# EAGLE design CHIP SmartPhone Core Rev 0.2 (EAGLE 8.1.1)
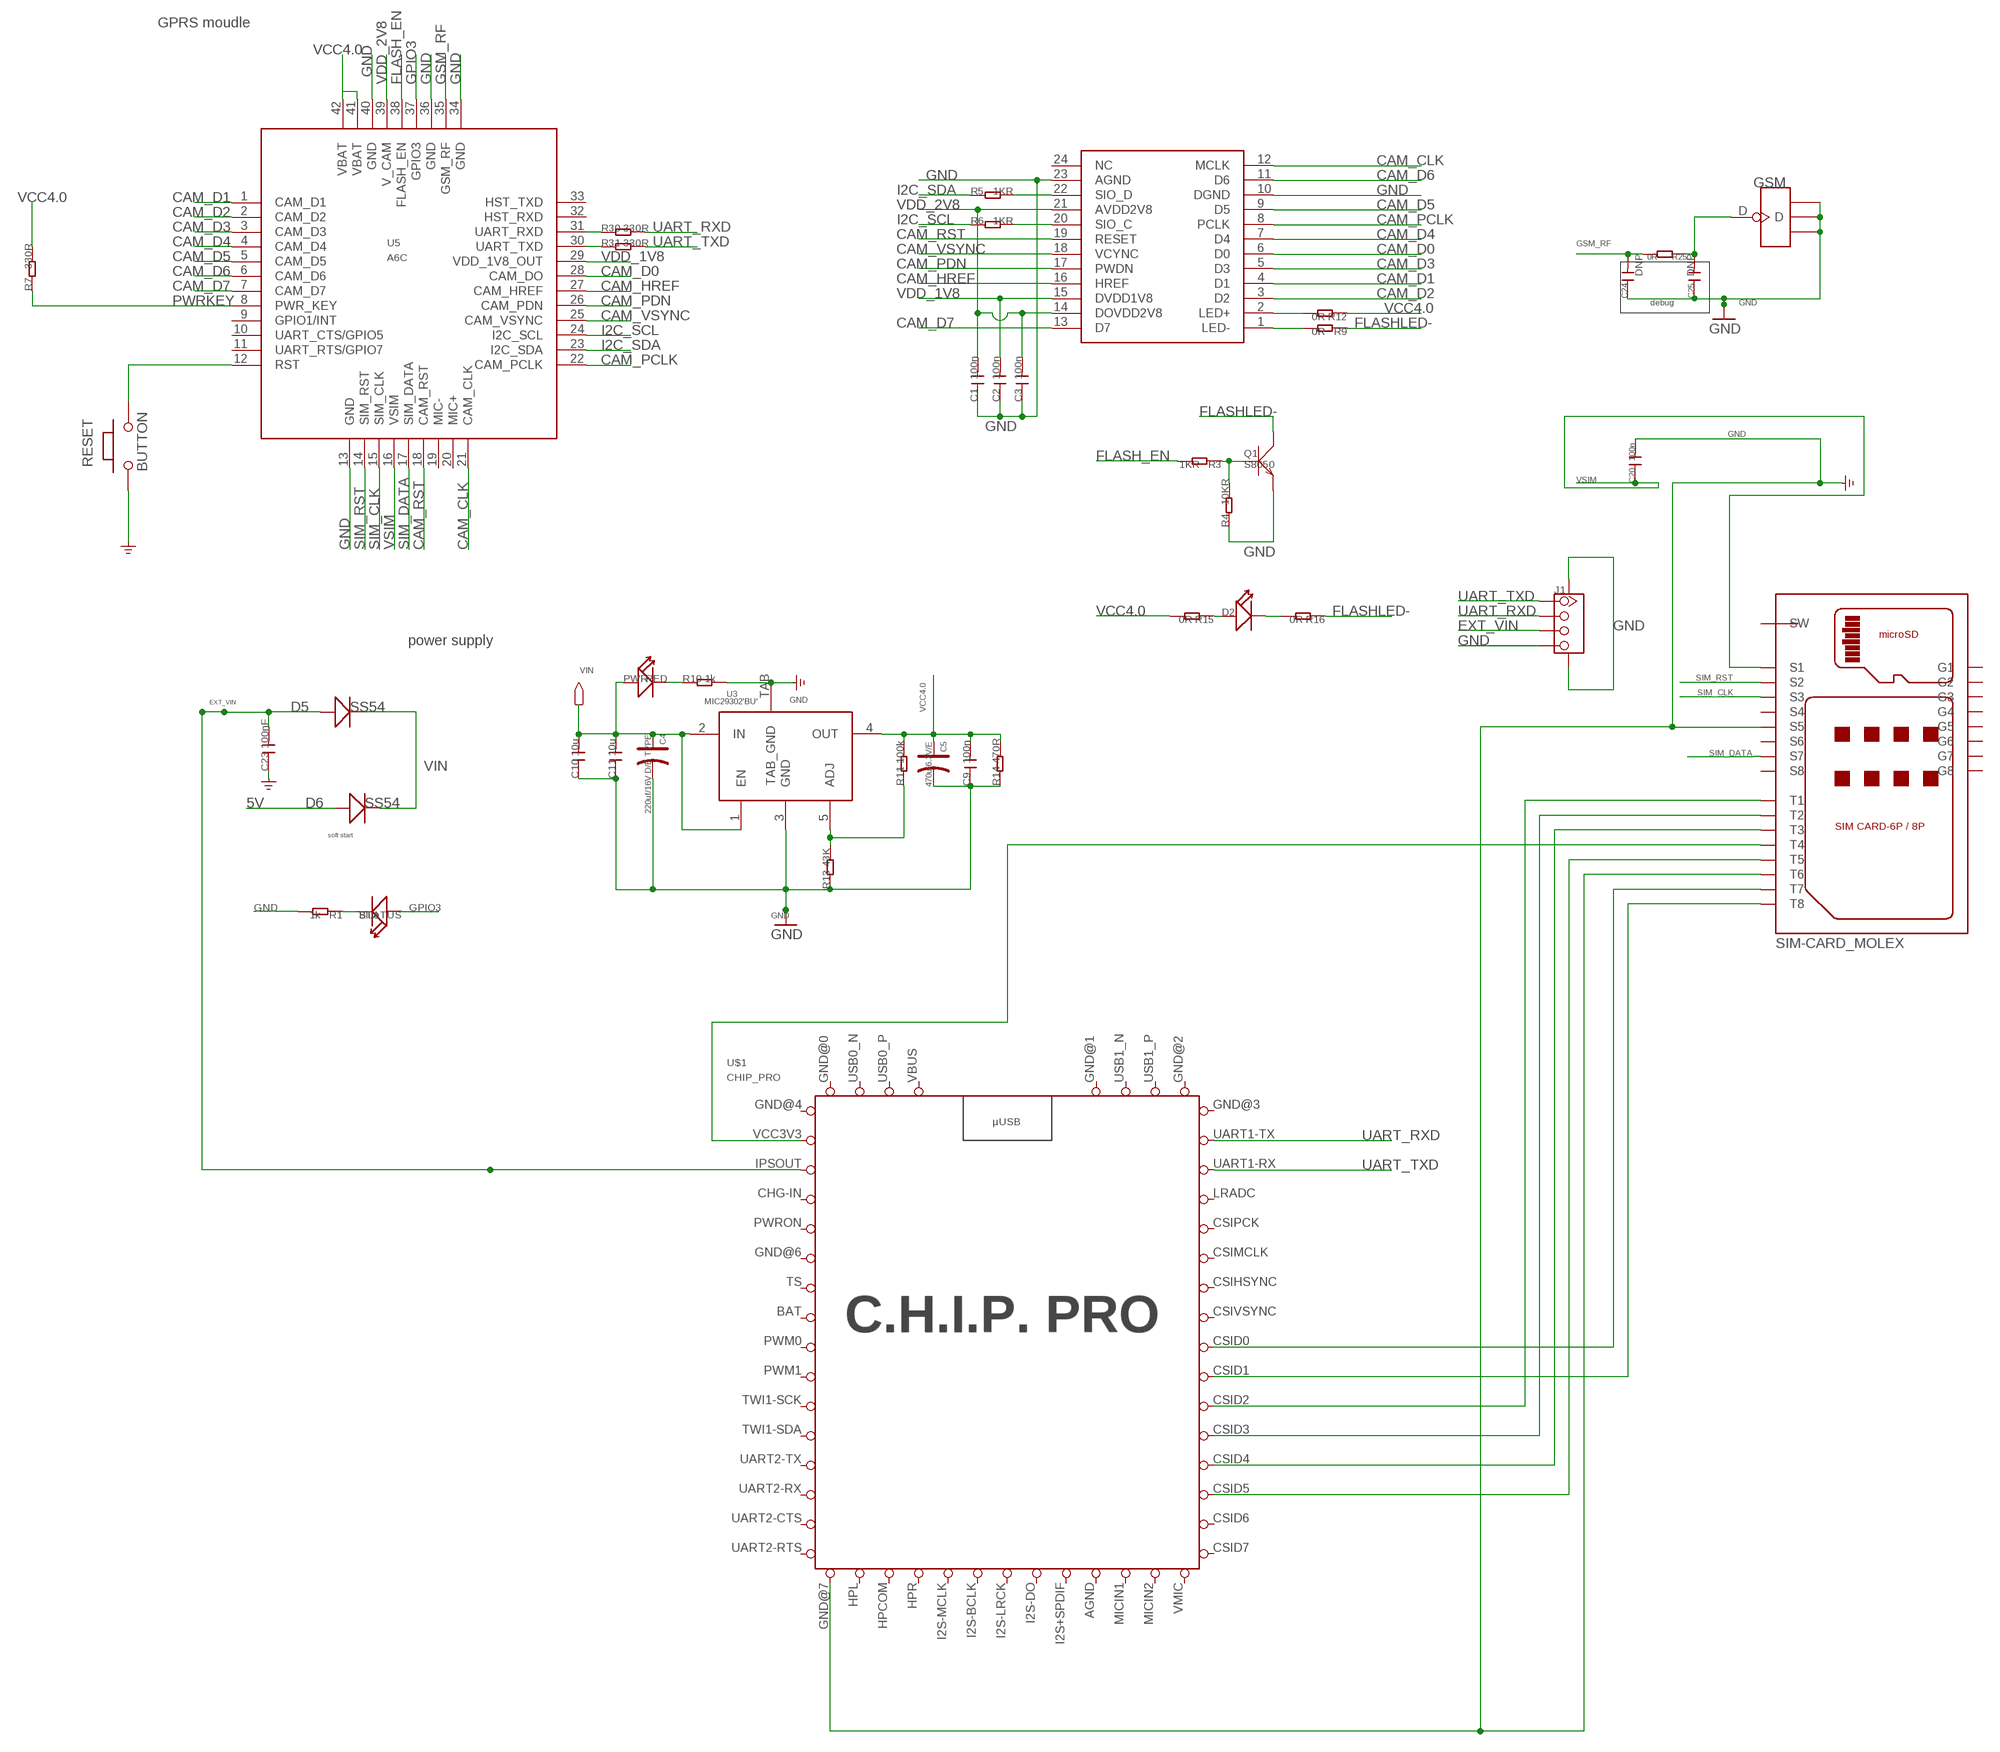
[diagram p0: schematic, sheet 1]

## Parts
C1  100n  C-0603  [C0603]
C2  100n  C-0603  [C0603]
C3  100n  C-0603  [C0603]
C4  220uf/16V D/E TYPE  006-CAP_AVX_D  [AVX_D]
C5  470u/6.3V/E  006-CAP_AVX_D  [AVX_D]
C9  100n  C-0603  [C0603]
C10  10u  C-0603  [C0603]
C11  10u  C-0603  [C0603]
C20  100n  C-0603  [C0603]
C23  100nF  C-0603  [C0603]
C24  DNP  C-0402  [C0402]
C25  DNP  C-0402  [C0402]
D2  LED'0805'  [LED-0805]
D5  SS54  D'MBRS240LT3'  [SMB]
D6  SS54  D'MBRS240LT3'  [SMB]
GSM  ANTENNA-U-FL  [4P-U-FL]
J1  TWIG-4P-2.0-SMD-FEMALE-REINFORCE'90D'  [4P-SMD-2.0-90D]
PWR  RED  007-LED0603  [D0603]
Q1  S8050  TRANSISTOR-NPN-SOT23  [SOT23]
R1  1k  R-0603  [R0603]
R3  1KR  R-0603  [R0603]
R4  10KR  R-0603  [R0603]
R5  1KR  R-0603  [R0603]
R6  1KR  R-0603  [R0603]
R7  330R  R-0603  [R0603]
R9  0R  R-0603  [R0603]
R10  1k  R-0603  [R0603]
R11  100k  R-0603  [R0603]
R12  0R  R-0603  [R0603]
R13  43K  R-0603  [R0603]
R14  470R  R-0603  [R0603]
R15  0R  R-0603  [R0603]
R16  0R  R-0603  [R0603]
R25  0R  R-0402  [R0402]
R30  330R  R-0603  [R0603]
R31  330R  R-0603  [R0603]
RESET  BUTTON  PB157  [157SW]
STATUS  Blue  007-LED0603  [D0603]
U1  FPC-SOCKET-0.5-24P  [24P-0.5-90D]
U3  MIC29302'BU'  [TO-263]
U5  A6C  [A6C]
U$1  CHIP_PRO  [CHIP_PRO]
U$4  SIM-CARD_MOLEX  [SIM-CARD_MOLEX]

## Nets
5V: D6.+
CAM_CLK: U1.12(MCLK) U5.21(CAM_CLK)
CAM_D0: U1.6(D0) U5.28(CAM_DO)
CAM_D1: U1.4(D1) U5.1(CAM_D1)
CAM_D2: U1.3(D2) U5.2(CAM_D2)
CAM_D3: U1.5(D3) U5.3(CAM_D3)
CAM_D4: U1.7(D4) U5.4(CAM_D4)
CAM_D5: U1.9(D5) U5.5(CAM_D5)
CAM_D6: U1.11(D6) U5.6(CAM_D6)
CAM_D7: U1.13(D7) U5.7(CAM_D7)
CAM_HREF: U1.16(HREF) U5.27(CAM_HREF)
CAM_PCLK: U1.8(PCLK) U5.22(CAM_PCLK)
CAM_PDN: U1.17(PWDN) U5.26(CAM_PDN)
CAM_RST: U1.19(RESET) U5.18(CAM_RST)
CAM_VSYNC: U1.18(VCYNC) U5.25(CAM_VSYNC)
EXT_VIN: C23.2 D5.+ J1.3 U$1.IPSOUT
FLASH_EN: R3.2 U5.38(FLASH_EN)
FLASHLED-: Q1.3(C) R9.1 R16.1
GND: C1.1 C2.1 C3.1 C4.- C5.- C9.1 C10.1 C11.1 C20.2 C23.1 C24.1 C25.1 GSM.GND1 GSM.GND2 GSM.GND3 J1.4 J1.SS1 J1.SS2 Q1.2(E) R1.2 R4.1 R10.2 R13.1 R14.1 RESET.1 U1.10(DGND) U1.23(AGND) U3.3(GND) U3.TAB(TAB_GND) U5.13(GND) U5.34(GND) U5.36(GND) U5.40(GND) U$1.GND@7(GND) U$4.S5 U$4.T6
GPIO3: STATUS.+ U5.37(GPIO3)
GSM_RF: C24.2 R25.2 U5.35(GSM_RF)
I2C_SCL: R6.1 U5.24(I2C_SCL)
I2C_SDA: R5.1 U5.23(I2C_SDA)
N$1: R1.1 STATUS.-
N$2: R30.1 U5.31(UART_RXD)
N$3: Q1.1(B) R3.1 R4.2
N$4: R31.1 U5.30(UART_TXD)
N$5: R11.1 R13.2 U3.5(ADJ)
N$6: D2.+ R15.1
N$7: RESET.2 U5.12(RST)
N$8: R5.2 U1.22(SIO_D)
N$9: D2.- R16.2
N$10: R6.2 U1.20(SIO_C)
N$11: U$1.CSID2 U$4.T1
N$12: U$1.CSID3 U$4.T2
N$13: U$1.CSID4 U$4.T3
N$14: U$1.CSID5 U$4.T5
N$16: U$1.VCC3V3 U$4.T4
N$17: U$1.CSID0 U$4.T7
N$18: U$1.CSID1 U$4.T8
N$19: PWR.- R10.1
N$20: R9.2 U1.1(LED-)
N$21: R12.2 U1.2(LED+)
N$25: C25.2 GSM.D R25.1
PWRKEY: R7.1 U5.8(PWR_KEY)
SIM_CLK: U5.15(SIM_CLK) U$4.S3
SIM_DATA: U5.17(SIM_DATA) U$4.S7
SIM_RST: U5.14(SIM_RST) U$4.S2
UART_RXD: J1.2 R30.2 U$1.UART1-TX
UART_TXD: J1.1 R31.2 U$1.UART1-RX
VCC4.0: C5.+ C9.2 R7.2 R11.2 R12.1 R14.2 R15.2 U3.4(OUT) U5.41(VBAT) U5.42(VBAT)
VDD_1V8: C2.2 U1.15(DVDD1V8) U5.29(VDD_1V8_OUT)
VDD_2V8: C1.2 C3.2 U1.14(DOVDD2V8) U1.21(AVDD2V8) U5.39(V_CAM)
VIN: C4.+ C10.2 C11.2 D5.- D6.- PWR.+ U3.1(EN) U3.2(IN)
VSIM: C20.1 U5.16(VSIM) U$4.S1
Unconnected: U1.24(NC) U5.9(GPIO1/INT) U5.10(UART_CTS/GPIO5) U5.11(UART_RTS/GPIO7) U5.19(MIC-) U5.20(MIC+) U5.32(HST_RXD) U5.33(HST_TXD) U$1.BAT U$1.CSID6 U$1.CSID7 U$1.CSIHSYNC U$1.CSIMCLK U$1.CSIPCK U$1.CSIVSYNC U$1.HPCOM U$1.HPL U$1.HPR U$1.I2S+SPDIF(I2SSPDIF) U$1.I2S-BCLK(I2SBCLK) U$1.I2S-DO(I2SDO) U$1.I2S-LRCK(I2SLRCK) U$1.I2S-MCLK(I2SMCLK) U$1.LRADC U$1.MICIN1 U$1.MICIN2 U$1.PWM0 U$1.PWM1 U$1.PWRON U$1.TS U$1.TWI1-SCK U$1.TWI1-SDA U$1.UART2-CTS U$1.UART2-RTS U$1.UART2-RX U$1.UART2-TX U$1.USB0_N U$1.USB0_P U$1.USB1_N U$1.USB1_P U$1.VMIC U$4.G1 U$4.G2 U$4.G3 U$4.G4 U$4.G5 U$4.G6 U$4.G7 U$4.G8 U$4.S4 U$4.S6 U$4.S8 U$4.SW

## Notes on the sheet
- GPRS moudle
- debug
- power supply
- soft start

## Power pins joined to a net without a drawn wire
AGND: U$1.AGND
CHG-IN: U$1.CHG-IN
GND: U$1.GND@0(GND) U$1.GND@1(GND) U$1.GND@2(GND) U$1.GND@3(GND) U$1.GND@4(GND) U$1.GND@6(GND)
VBUS: U$1.VBUS

## Library data of the parts
C1-C3 C9-C11 C20 C23-C25 = Discrete:C*: Ceramic Capacitors
C4 C5 = Discrete:006-CAP*: Electrolytic Capacitors,Tantalum Capacitors and Super Capacitors
D2 = Discrete:LED*
D5 D6 = Discrete:D*
GSM = Connector:ANTENNA-U-FL
J1 = Connector:TWIG-4P-2.0-SMD-FEMALE-REINFORCE
PWR STATUS = Discrete:007-LED*
Q1 = Discrete:TRANSISTOR-NPN*: NPN audion
R1 R3-R7 R9-R16 R25 R30 R31 = Discrete:R*
RESET = MySMD:PB157
U1 = Connector:FPC-SOCKET-0.5-24P
U3 = ICs_v54:MIC29302
U5 = IC:A6C
U$1 = CHIP_Pro-Footprint:CHIP_PRO
U$4 = Molex3:SIM-CARD_MOLEX

## Net classes
1 power: width 0.61 mm, drill 0.61 mm, clearance 0.203 mm
2 gnd: width 0.305 mm, drill 0.559 mm, clearance 0.203 mm
3 usbvcc: width 0.508 mm, drill 0.61 mm, clearance 0.203 mm
4 aref: width 0.254 mm, drill 0.61 mm, clearance 0.254 mm

## Board
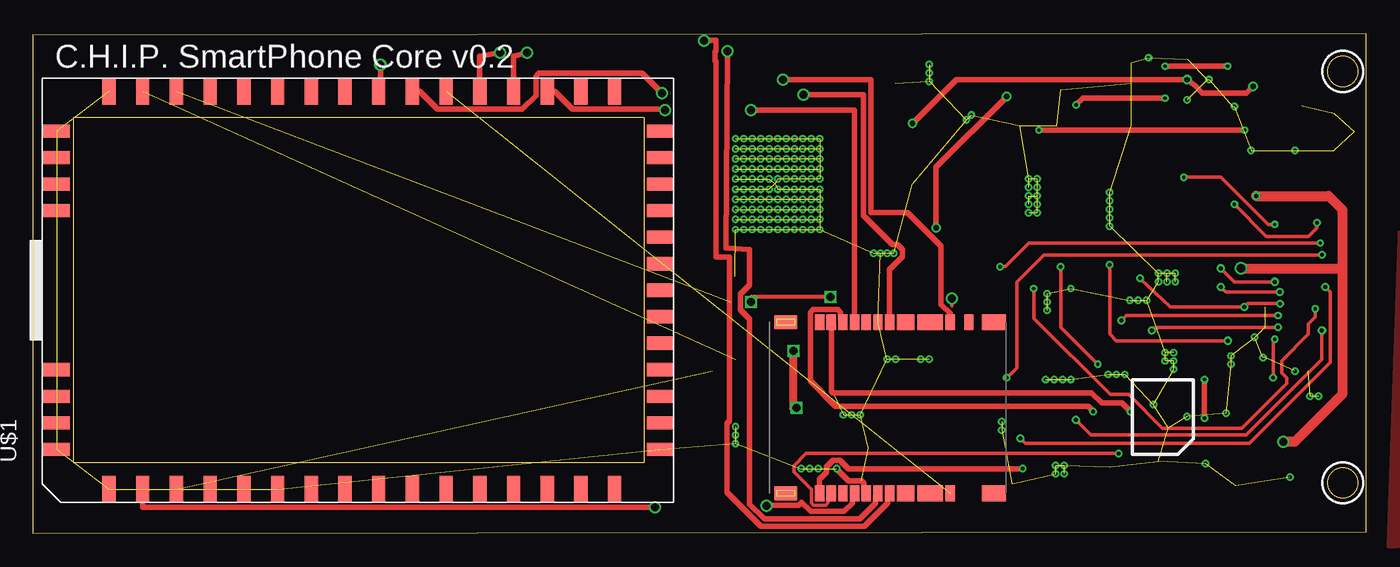
[diagram p1: board, top side]
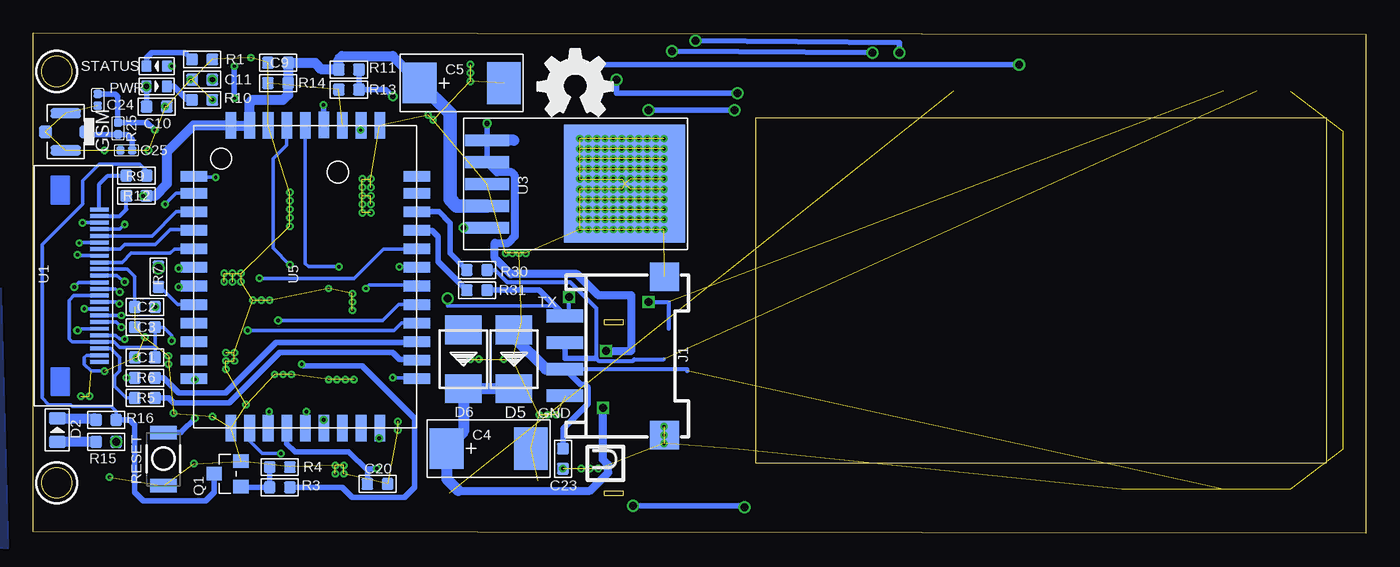
[diagram p2: board, bottom side, seen from below]

Size 100.46 x 37.72 mm. Coordinates in mm from the lower left corner, seen from the top.
Outline: 0,0 0,37.59 100.46,37.72 100.46,0.13 0,0
Outline: circle at 98.67,34.83 radius 1.14
Outline: circle at 98.67,3.83 radius 1.14
Copper layers (1*16): Top 0.035mm / dielectric 1.5mm / Bottom 0.035mm
Design rules "default": minimum track width 6mil, minimum drill 10mil, track to track 6mil, track to pad 6mil, pad to pad 6mil, via to via 6mil, smd to smd 0mil, copper to edge 10mil, drill to drill 10mil, minimum pad ring 10mil, minimum via ring 6mil, stop-mask expansion 2mil, vias tented up to drill 100mil, thermal gap 10mil
tRestrict: area 97.1,33.3 to 100.2,36.4; area 97.1,2.3 to 100.2,5.4
bRestrict: area 97.1,33.3 to 100.2,36.4; area 97.1,2.3 to 100.2,5.4

### Footprints (pad centres in the part's own frame; a part is rotated, then mirrored left to right if it is on the bottom)
C0603 = smd 0.889 x 0.889: 1 -0.762,0; 2 0.762,0
AVX_D = smd 2.54 x 3.048: + -3.175,0 | smd 2.54 x 3.175: - 3.175,0
C0402 = smd 0.635 x 0.635: 1 -0.445,0; 2 0.445,0
LED-0805 = smd 0.889 x 1.27: + -0.889,0; - 0.889,0
SMB = smd 2.159 x 2.743: + -2.21,0; - 2.21,0
4P-U-FL = smd 1.016 x 1.016: D -1.524,0; GND3 1.524,0 | smd 2.286 x 0.762: GND1 0,1.397; GND2 0,-1.397
4P-SMD-2.0-90D = smd 0.965 x 2.74: 1 -3,-0.1; 2 -1,-0.1; 3 1,-0.1; 4 3,-0.1 | smd 2.159 x 2.184: SS1 -5.974,7.4; SS2 5.974,7.4
D0603 = smd 0.762 x 0.889: + -0.762,0; - 0.762,0
SOT23 = smd 1.016 x 1.143: 1 -0.95,-1.016; 2 0.95,-1.016; 3 0,1.016
R0603 = smd 0.889 x 0.889: 1 -0.762,0; 2 0.762,0
R0402 = smd 0.635 x 0.635: 1 -0.445,0; 2 0.445,0
157SW = smd 1.016 x 1.981: 1 0,0; 2 4,0
24P-0.5-90D = smd 0.3 x 1.4: 1 5.08,-1.27; 2 4.58,-1.27; 3 4.08,-1.27; 4 3.58,-1.27; 5 3.08,-1.27; 6 2.58,-1.27; 7 2.08,-1.27; 8 1.58,-1.27; 9 1.08,-1.27; 10 0.58,-1.27; 11 0.08,-1.27; 12 -0.42,-1.27; 13 -0.92,-1.27; 14 -1.42,-1.27; 15 -1.92,-1.27; 16 -2.42,-1.27; 17 -2.92,-1.27; 18 -3.42,-1.27; 19 -3.92,-1.27; 20 -4.42,-1.27; 21 -4.92,-1.27; 22 -5.42,-1.27; 23 -5.92,-1.27; 24 -6.42,-1.27
TO-263 = smd 3.302 x 0.889: 1 3.302,-3.302; 2 3.302,-1.651; 3 3.302,0; 4 3.302,1.651; 5 3.302,3.302 | smd 9.12 x 8.89: TAB -7.071,-0.03
A6C = smd 0.8 x 2: 1 7.57,8.4; 2 6.3,8.4; 3 4.9,8.4; 4 3.5,8.4; 5 2.1,8.4; 6 0.7,8.4; 7 -0.7,8.4; 8 -2.1,8.4; 9 -3.5,8.4; 10 -4.9,8.4; 11 -6.3,8.4; 12 -7.7,8.4; 22 -7.7,-8.4; 23 -6.3,-8.4; 24 -4.9,-8.4; 25 -3.5,-8.4; 26 -2.1,-8.4; 27 -0.7,-8.4; 28 0.7,-8.4; 29 2.1,-8.4; 30 3.5,-8.4; 31 4.9,-8.4; 32 6.3,-8.4; 33 7.57,-8.4 | smd 2 x 0.8: 13 -11.4,5.6; 14 -11.4,4.2; 15 -11.4,2.8; 16 -11.4,1.4; 17 -11.4,0; 18 -11.4,-1.4; 19 -11.4,-2.8; 20 -11.4,-4.2; 21 -11.4,-5.6; 34 11.4,-5.6; 35 11.4,-4.2; 36 11.4,-2.8; 37 11.46,-1.4; 38 11.4,0; 39 11.4,1.4; 40 11.4,2.8; 41 11.4,4.2; 42 11.4,5.6
CHIP_PRO = smd 1 x 2: AGND 6,-22.5; GND@1 -12,-22.5; GND@4 -12,23; GND@6 6,23; GND@7 12,23; HPCOM -8,-22.5; HPL -10,-22.5; HPR -6,-22.5; I2S+SPDIF 4,-22.5; I2S-BCLK -2,-22.5; I2S-DO 2,-22.5; I2S-LRCK 0,-22.5; I2S-MCLK -4,-22.5; MICIN1 8,-22.5; MICIN2 10,-22.5; USB0_N -10,23; USB0_P -8,23; USB1_N 8,23; USB1_P 10,23; VBUS -6,23; VMIC 12,-22.5 | smd 2 x 1: BAT -15,1.27; CHG-IN -15,11.43; CSID0 15,-1.27; CSID1 15,-3.81; CSID2 15,-6.35; CSID3 15,-8.89; CSID4 15,-11.43; CSID5 15,-13.97; CSID6 15,-16.51; CSID7 15,-19.05; CSIHSYNC 15,3.81; CSIMCLK 15,6.35; CSIPCK 15,8.89; CSIVSYNC 15,1.27; GND@0 15,19.05; GND@2 -15,6.35; GND@3 -15,19.05; IPSOUT -15,13.97; LRADC 15,11.43; PWM0 -15,-1.27; PWM1 -15,-3.81; PWRON -15,8.89; TS -15,3.81; TWI1-SCK -15,-6.35; TWI1-SDA -15,-8.89; UART1-RX 15,13.97; UART1-TX 15,16.51; UART2-CTS -15,-16.51; UART2-RTS -15,-19.05; UART2-RX -15,-13.97; UART2-TX -15,-11.43; VCC3V3 -15,16.51
SIM-CARD_MOLEX = smd 1.05 x 1.7: G1 0,1.2; G8 12.91,1.2 | smd 1.2 x 1.34: G2 0,10.25; G7 12.91,10.25 | smd 1.2 x 1.94: G3 0,12.09; G6 12.91,12.09 | smd 1.2 x 1.8: G4 0,16.9; G5 12.91,16.9 | smd 1.2 x 0.7: S1 12.91,3.76; S2 12.91,4.64; S3 0,4.64; S4 0,3.76; S5 12.91,7.28; S6 12.91,5.52; S7 0,5.52; S8 0,7.28; SW 0,15.015; T1 12.91,13.6; T2 12.91,9.04; T3 12.91,8.16; T4 12.91,6.4; T5 0,6.4; T6 0,8.16; T7 0,9.04; T8 0,13.6

### Placement (x,y rotation side)
C1  92.04,13.26 0 bottom
C2  92.04,17.07 0 bottom
C3  92.04,15.55 0 bottom
C4  66.13,6.4 0 bottom
C5  68.16,33.96 0 bottom
C9  82,35.48 0 bottom
C10  91.15,32.18 180 bottom
C11  87.72,34.22 0 bottom
C20  74.51,3.73 0 bottom
C23  60.54,5.64 90 bottom
C24  95.59,32.69 90 bottom
C25  93.43,28.88 0 bottom
D2  98.64,7.8 90 bottom
D5  64.22,13.13 270 bottom
D6  68.03,13.13 270 bottom
GSM  98.01,30.28 180 bottom
J1  60.29,13.39 270 bottom
LOGO2  LOGO-OSHW-FILLX0200-NT  [OSHW_FILLX200_NOTEXT]  62.45,31.46 0 bottom
PWR  91.15,33.71 0 bottom
Q1  85.81,4.5 90 bottom
R1  87.72,35.74 0 bottom
R3  81.88,3.48 0 bottom
R4  81.88,5 180 bottom
R5  92.04,10.21 180 bottom
R6  92.04,11.74 180 bottom
R7  91.02,19.36 90 bottom
R9  92.67,26.98 180 bottom
R10  87.72,32.69 0 bottom
R11  76.67,34.98 180 bottom
R12  92.67,25.45 180 bottom
R13  76.67,33.45 0 bottom
R14  82,33.96 0 bottom
R15  94.96,6.91 0 bottom
R16  94.96,8.56 180 bottom
R25  94.07,30.53 90 bottom
R30  67.02,19.86 0 bottom
R31  67.02,18.34 0 bottom
RESET  90.64,3.61 90 bottom
STATUS  91.15,35.23 180 bottom
U1  96.74,19.36 90 bottom
U3  62.95,26.34 180 bottom
U5  79.95,19.36 90 bottom
U$1  24.76,18.34 90 top
U$4  55.5,15.93 270 top

### Tracks (layer width: path | path; a pad name or v marks a point on that pad's centre or on a via)
CAM_CLK  (via drill 0.3)
  Top 0.254: v74.38,7.16 74.77,6.78 91.66,6.78 97.75,12.88 97.75,18.21 v97.37,18.59
  Bottom 0.254: U1.12 97.03,18.94 v97.37,18.59 | v74.38,7.16 74.38,7.92 U5.21
CAM_D0  (via drill 0.25)
  Top 0.254: v96.99,21.9 75.02,21.9 73.24,20.12 v72.86,20.12
  Bottom 0.254: U1.6 96.95,21.94 v96.99,21.9 | v72.86,20.12 71.61,20.12 U5.28
CAM_D1  (via drill 0.25)
  Top 0.254: v86.7,26.85 89.5,26.85 93.05,23.29 v93.56,23.29
  Bottom 0.254: U1.4 93.92,22.94 v93.56,23.29 | v86.7,26.85 88.27,26.85 U5.1
CAM_D2  (via drill 0.25)
  Top 0.254: v96.74,23.42 96.74,23.04 96.1,22.4 92.93,22.4 v90.51,24.82
  Bottom 0.254: U1.3 96.72,23.44 v96.74,23.42 | v90.51,24.82 89.67,25.66 U5.2
CAM_D3
  Bottom 0.254: U1.5 91.5,22.44 89.68,24.26 U5.3
CAM_D4
  Bottom 0.254: U5.4 88.4,22.91 90.13,22.91 91.28,21.77 93.56,21.77 93.89,21.44 U1.7
CAM_D5
  Bottom 0.254: U1.9 93.75,20.44 93.05,21.13 90.13,21.13 89.81,21.46 U5.5
CAM_D6  (via drill 0.3)
  Top 0.254: v93.56,18.97 90.51,18.97 v89.5,19.99
  Bottom 0.254: U1.11 94.15,19.44 v93.56,18.97 | v89.5,19.99 88.41,19.99 U5.6
CAM_D7  (via drill 0.3)
  Top 0.254: v93.94,18.21 89.88,18.21 v89.5,18.59
  Bottom 0.254: U1.13 94.29,18.44 v93.94,18.21 | v89.5,18.59 88.41,18.59 U5.7
CAM_HREF  (via drill 0.25)
  Top 0.254: v96.61,16.94 96.61,16.31 96.1,15.8 96.1,15.04 94.07,13.01 94.07,12.12 94.45,11.74 94.45,11.32 91.06,7.93 85.09,7.93 82.55,10.47 81.15,10.47 75.4,16.22 v75.4,18.47
  Bottom 0.254: U1.16 v96.6,16.94 v96.61,16.94 | v75.4,18.47 75.15,18.72 71.61,18.72 U5.27
CAM_PCLK  (via drill 0.25)
  Top 0.254: v97.12,21.01 76.16,21.01 74.13,18.97 74.13,12.5 v73.37,11.74
  Bottom 0.254: U1.8 97.05,20.94 v97.12,21.01 | v73.37,11.74 71.63,11.74 U5.22
CAM_PDN  (via drill 0.25, 0.3)
  Top 0.254: v93.81,16.43 82.39,16.43 v82,16.05
  Bottom 0.254: U1.17 94.45,16.44 v93.81,16.43 | v82,16.05 74.13,16.05 72.93,17.26 U5.26
CAM_RST  (via drill 0.3)
  Top 0.254: v97.12,15.29 97.12,13.13 91.4,7.42 79.72,7.42 v78.58,8.56
  Bottom 0.254: U1.19 96.97,15.44 v97.12,15.29 | v78.58,8.56 78.58,7.98 U5.18
CAM_VSYNC  (via drill 0.25, 0.3)
  Top 0.254: v93.81,15.55 84.54,15.55 v84.29,15.29
  Bottom 0.254: U1.18 94.2,15.94 v93.81,15.55 | v84.29,15.29 73.24,15.29 72.68,15.86 U5.25
EXT_VIN  (1 unrouted)
  Bottom 0.305: J1.3 51.18,12.39 51.18,12.24
  Bottom 0.406: J1.3 59.23,11.22 58.87,11.22 58.66,11.02 58.66,9.76 60.54,7.88 C23.2
  Bottom 0.813: D5.+ 64.22,14.78 61.83,12.39 J1.3
FLASH_EN  (via drill 0.25)
  Top 0.254: v77.43,20.12 77.43,15.55 v80.23,12.75
  Bottom 0.254: U5.38 79.95,20.35 79.72,20.12 v77.43,20.12
  Bottom 0.406: R3.2 77.18,3.48 76.42,2.72 72.48,2.72 71.72,3.48 71.72,8.69 75.65,12.62 80.1,12.62 v80.23,12.75
FLASHLED-
  Bottom 0.254: R9.1 91.91,27.36 92.42,27.86 95.47,27.86 96.74,26.59 96.74,24.82 99.78,21.77 99.78,10.21 99.28,9.7 97.62,9.7 97.5,9.58 94.58,9.58 94.2,9.2 R16.1
  Bottom 0.406: R16.1 93.18,8.56 92.8,8.18 92.8,3.1 92.16,2.46 87.47,2.46 86.83,3.1 Q1.3
GND  (via drill 0.25)  (233 unrouted)
  Top 0.406: U$4.S5 62.61,3.19 62.61,3.76 62.4,3.97 61.45,3.97 C23.1
  Bottom 0.254: U1.10 93.38,19.94 92.8,19.36 C2.1 | U1.23 96.43,13.44 96.61,13.26 96.61,12.75 96.1,12.24 v95.09,12.24
  other vias: 89.88,9.07 92.67,13.26 96.23,10.34 94.7,4.24 88.35,5.26 92.04,14.78 90.26,12.75 86.96,32.69 88.61,34.22 84.04,35.87 67.53,34.72 63.84,21.13 70.7,31.55 70.32,31.17 64.35,21.13 64.86,21.13 63.34,21.13 67.53,34.09 67.53,35.36 90.51,32.18 91.78,28.88 95.09,28.88 60.54,4.88 57.87,4.88 52.92,8.05 52.92,7.42 52.92,6.78 86.96,8.81 85.94,13.01 82.26,11.99 77.69,5.13 77.69,4.5 77.05,5.13 77.05,4.5 85.31,13.01 85.94,12.37 85.94,13.64 85.31,13.64 81.62,11.99 80.99,11.99 84.42,9.7 82.64,17.58 86.07,19.61 76.92,11.61 67.53,13.13 72.99,8.43 78.19,18.47 76.42,17.45 81.12,23.17 81.12,23.8 81.12,24.44 77.56,11.61 78.19,11.61 76.29,11.61 76.42,18.09 76.42,16.82 85.43,19.61 84.8,19.61 84.8,18.97 85.43,18.97 86.07,18.97 83.27,17.58 83.91,17.58 90.26,13.39 96.86,10.34 72.99,7.8 66.89,13.13 64.99,13.13 64.35,13.13 75.65,26.72 75.02,26.72 75.65,26.09 75.65,25.45 75.65,24.82 75.65,24.18 75.02,26.09 75.02,25.45 75.02,24.82 75.02,24.18 81.12,25.07 81.12,25.71 59.27,29.77 58.64,29.77 58,29.77 57.37,29.77 56.73,29.77 56.1,29.77 55.46,29.77 54.83,29.77 54.19,29.77 53.56,29.77 52.92,29.77 59.27,28.25 58.64,28.25 58,28.25 57.37,28.25 56.73,28.25 56.1,28.25 55.46,28.25 54.83,28.25 54.19,28.25 53.56,28.25 52.92,28.25 59.27,29.01 58.64,29.01 58,29.01 57.37,29.01 56.73,29.01 56.1,29.01 55.46,29.01 54.83,29.01 54.19,29.01 53.56,29.01 52.92,29.01 59.27,27.48 58.64,27.48 58,27.48 57.37,27.48 56.73,27.48 56.1,27.48 55.46,27.48 54.83,27.48 54.19,27.48 53.56,27.48 52.92,27.48 59.27,26.72 58.64,26.72 58,26.72 57.37,26.72 56.73,26.72 56.1,26.72 55.46,26.72 54.83,26.72 54.19,26.72 53.56,26.72 52.92,26.72 59.27,25.96 58.64,25.96 58,25.96 57.37,25.96 56.73,25.96 56.1,25.96 55.46,25.96 54.83,25.96 54.19,25.96 53.56,25.96 52.92,25.96 59.27,25.2 58.64,25.2 58,25.2 57.37,25.2 56.73,25.2 56.1,25.2 55.46,25.2 54.83,25.2 54.19,25.2 53.56,25.2 52.92,25.2 59.27,24.44 58.64,24.44 58,24.44 57.37,24.44 56.73,24.44 56.1,24.44 55.46,24.44 54.83,24.44 54.19,24.44 53.56,24.44 52.92,24.44 59.27,23.67 58.64,23.67 58,23.67 57.37,23.67 56.73,23.67 56.1,23.67 55.46,23.67 54.83,23.67 54.19,23.67 53.56,23.67 52.92,23.67 59.27,22.91 58.64,22.91 58,22.91 57.37,22.91 56.73,22.91 56.1,22.91 55.46,22.91 54.83,22.91 54.19,22.91 53.56,22.91 52.92,22.91 62.32,8.94 61.68,8.94 61.05,8.94 59.14,4.88 58.51,4.88
  pour Top (isolate 0.254): 102.2,-0.96 107.66,-0.58 109.06,38.53 103.59,38.15
  pour Bottom (isolate 0.254): 102.45,-1.09 113.75,0.31 114.9,39.55 103.59,38.15
GPIO3  (via drill 0.25)
  Top 0.406: v90.01,35.23 v85.31,35.23 | v85.31,32.82 79.08,32.82 v78.58,32.31
  Bottom 0.406: STATUS.+ v90.01,35.23 | v85.31,35.23 v85.31,32.82 | v78.58,32.31 78.58,30.84 U5.37
GSM_RF  (via drill 0.25)
  Top 0.406: v91.28,30.4 v75.78,30.4
  Bottom 0.406: v91.28,30.4 91.85,30.98 R25.2 94.07,32.95 94.26,33.14 C24.2 | 75.78,30.66 v75.78,30.4 75.75,30.44 U5.35
I2C_SCL
  Bottom 0.406: R6.1 90.64,11.74 89.5,10.59 85.94,10.59 82.13,14.4 71.6,14.4 U5.24
I2C_SDA
  Bottom 0.406: R5.1 90.26,10.21 89.88,9.83 85.69,9.83 81.88,13.64 73.37,13.64 72.86,13.13 71.62,13.13 U5.23
N$1
  Bottom 0.406: STATUS.- 91.91,35.87 91.53,36.25 88.99,36.25 R1.1
N$2
  Bottom 0.406: U5.31 69.89,24.26 69.05,23.42 69.05,21.13 R30.1
N$3
  Bottom 0.406: Q1.1 84.73,3.48 R3.1 R4.2
N$4
  Bottom 0.406: U5.30 70.39,22.86 69.94,22.4 69.94,20.5 R31.1
N$5  (via drill 0.41)
  Top 0.406: v68.03,23.04 68.03,27.61 v73.37,32.95
  Bottom 0.406: R11.1 R13.2 73.88,33.45 v73.37,32.95 | U3.5 v68.03,23.04
N$6
  Bottom 0.762: R15.1 D2.+
N$7  (via drill 0.25)
  Top 0.406: v88.27,8.69 v88.27,11.61
  Bottom 0.406: RESET.2 89.31,7.61 89.31,7.65 v88.27,8.69 | v88.27,11.61 88.27,11.57 U5.12
N$8
  Bottom 0.254: U1.22 94.62,13.94 93.94,13.26 93.94,12.24 94.32,11.86 94.32,11.1 93.43,10.21 R5.2
N$9
  Bottom 0.762: D2.- 95.85,8.69 R16.2
N$10  (via drill 0.25)
  Top 0.254: v93.43,11.74 93.43,14.53 v93.56,14.66
  Bottom 0.254: U1.20 94.22,14.94 93.94,14.66 v93.56,14.66 | v93.43,11.74 R6.2
N$11  (1 unrouted)
N$12  (via drill 0.6)
  Top 0.406: U$4.T2 64.37,2.84 64.37,2.27 62.63,0.54 54.86,0.54 52.29,3.11 52.29,8.32 52.45,8.48 52.45,20.83 51.44,20.83 51.44,35.61 51.39,35.66 51.39,36.33 51.44,36.37 51.44,37.2 51.43,37.2 51.31,37.2 50.8,37.2 v50.55,37.14 | v35.18,36.25 33.66,35.99 U$1.CSID3
  Bottom 0.406: v50.55,37.14 35.18,37.01 v35.18,36.25
N$13  (via drill 0.6)
  Top 0.406: U$4.T3 63.48,2.84 63.48,2.27 62.31,1.1 55.52,1.1 55.09,1.1 53.97,2.21 53.97,16.17 53.29,16.85 53.29,18.05 53.97,18.73 53.97,21.39 52.2,21.51 v52.32,36.37 | v37.21,36.25 36.2,35.99 U$1.CSID4
  Bottom 0.406: v52.32,36.37 v37.21,36.25
N$14  (via drill 0.6)
  Top 0.406: U$1.CSID5 39.27,33.34 40.63,31.98 47.57,31.98 v47.62,31.93 | v54.1,31.93 61.9,31.93 U$4.T5
  Bottom 0.406: v47.62,31.93 v54.1,31.93
N$16  (via drill 0.6)
  Top 0.406: U$4.T4 61.73,2.84 61.73,2.27 61.11,1.66 58.99,1.66 58.59,1.66 57.9,2.34 57.7,2.14 55.3,2.14 v55.25,2.08 | v46.86,1.96 8.25,1.96 U$1.VCC3V3
  Bottom 0.406: v55.25,2.08 46.86,2.08 v46.86,1.96
N$17  (via drill 0.6)
  Top 0.406: U$1.CSID0 26.16,33.34 v26.16,35.36 | U$4.T7 64.54,19.92 65.49,20.87 65.49,21.4 65.12,21.77 64.74,21.77 62.56,23.95 62.56,33.07 v58.04,33.07
  Bottom 0.406: v26.16,35.36 58.04,35.36 v58.04,33.07
N$18  (via drill 0.6)
  Top 0.406: U$1.CSID1 29.11,33.34 30.47,31.98 36.84,31.98 37.88,33.02 37.88,34.49 38.09,34.7 45.87,34.7 v47.37,33.2 | v56.52,34.22 63.12,34.22 63.12,24.18 65.89,24.18 68.41,21.66 68.41,17.28 69.1,16.59 U$4.T8
  Bottom 0.406: v47.37,33.2 56.52,33.2 v56.52,34.22
N$19
  Bottom 0.406: PWR.- 89.88,33.71 88.86,32.69 R10.1
N$20
  Bottom 0.305: U1.1 95.47,26.34 94.83,26.98 R9.2
N$21
  Bottom 0.305: U1.2 93.93,23.94 93.43,24.44 R12.2
N$25
  Bottom 0.406: GSM.D 96.29,30.09 R25.1 93.37,30.09 92.99,29.71 C25.2
PWRKEY
  Bottom 0.254: R7.1 90.89,18.59 89.56,17.26 U5.8
SIM_CLK  (via drill 0.25)
  Top 0.406: v82.68,9.2 82.04,9.83 80.52,9.83 79.76,10.59 60.25,10.59 60.14,10.7 U$4.S3
  Bottom 0.406: v82.68,9.2 82.68,8.03 U5.15
SIM_DATA  (via drill 0.25)
  Top 0.406: v79.88,9.2 79.5,9.58 60.47,9.58 58.55,11.5 58.55,16.67 58.76,16.88 60.64,16.88 60.84,16.67 60.84,16.1 U$4.S7
  Bottom 0.406: v79.88,9.2 79.88,8.02 U5.17
SIM_RST  (via drill 0.25)
  Top 0.254: U$4.S2 59.89,2.77 59.89,2.3 59.73,2.14 58.79,2.14 58.63,2.3 58.63,3.33 57.31,4.65 57.31,5.11 58.23,6.02 v81.79,6.02
  Bottom 0.254: v81.79,6.02 83.19,6.02 84.15,6.98 U5.14
UART_RXD  (1 unrouted)
  Bottom 0.305: R30.2 65.65,19.86 64.73,18.95 59.98,18.95 58.03,17 58.03,13.19 57.86,13.01 55.27,13.01 55.15,13.13 52.96,13.13
  Bottom 0.406: 58.03,13.19 60.39,13.19 J1.2
UART_TXD  (via drill 0.6)  (1 unrouted)
  Top 0.254: v69.22,17.7 69.22,17.16
  Top 0.305: v60.07,17.83 54.1,17.83 v54.1,17.45
  Bottom 0.254: 61.14,17.14 69.22,17.14 v69.22,17.7
  Bottom 0.305: J1.1 60.07,16.39 v60.07,17.83 | v54.1,17.45 52.58,17.45 52.58,15.42
  Bottom 0.406: R31.2 62.34,18.34 61.14,17.14 J1.1
VCC4.0  (via drill 0.3, 0.61)
  Top 0.762: v91.02,19.99 98.64,19.99 | R15.2 95.09,6.91 98.64,10.47 98.64,19.99 | v92.16,25.45 97.62,25.45 98.64,24.44 98.64,19.99
  Bottom 0.254: R12.1 v92.16,25.45
  Bottom 0.762: C5.+ 73.37,35.99 77.18,35.99 77.43,35.74 R11.2 78.7,34.98 79.21,35.48 C9.2 R14.2 81.24,33.07 81.62,32.69 83.91,32.69 84.15,32.45 U5.41 U5.42 88.38,30.76 90.39,28.75 90.39,26.34 91.28,25.45 R12.1 | R7.2 v91.02,19.99
  Bottom 1.016: U3.4 68.54,24.69 69.05,25.2 69.05,31.67 C5.+
  other vias: 94.2,6.91
VDD_1V8  (via drill 0.25, 0.3)
  Top 0.254: v83.4,19.23 85.69,17.07 C2.2 91.53,17.32 v93.94,17.32
  Bottom 0.254: U5.29 74.06,21.46 76.29,19.23 v83.4,19.23 | U1.15 94.05,17.44 v93.94,17.32
  other vias: 91.28,17.07
VDD_2V8  (via drill 0.25, 0.3)
  Top 0.254: v90.01,14.53 81.62,14.53 81.12,15.04 v81.12,20.24
  Bottom 0.254: U1.14 97.39,17.94 97.75,17.58 97.75,14.66 97.53,14.44 U1.21 94.36,14.44 93.94,14.02 91.28,14.02 | 91.28,14.02 C3.2 90.64,15.55 90.01,14.91 v90.01,14.53 | 91.28,14.02 C1.2 | U5.39 81.35,29.28 82.39,28.25 82.39,21.51 v81.12,20.24
VIN  (via drill 0.41, 0.6)
  Top 0.406: v66.26,30.91 69.56,34.22 C11.2 87.59,33.71 88.1,33.2 91.4,33.2 PWR.+
  Top 0.61: v57.53,9.45 57.28,9.45 v57.28,13.77
  Bottom 0.406: C10.2 PWR.+ | 86.83,34.22 C11.2 | v66.26,30.91 U3.1 U3.2
  Bottom 0.61: 68.42,3.23 58.48,3.23 57.14,4.57 57.14,5.18 57.53,5.58 v57.53,9.45 | v57.28,13.77 55.37,13.77 55.37,17.96 57.87,17.96 59.47,19.56 64.48,19.56 65.69,20.77 65.69,21.9 64.65,21.9 64.15,22.4 64.15,26.97 64.42,27.24 65.51,27.24 U3.2
  Bottom 0.813: 68.42,3.23 69.3,4.12 C4.+ 68.03,7.67 D6.- D5.- | 64.22,29.64 U3.1
  other vias: 91.91,33.71 86.96,34.22
VSIM  (via drill 0.25)
  Top 0.406: U$4.S1 59.26,4.09 59.78,4.62 59.78,5.01 60.28,5.51 60.8,5.51 61.44,4.88 v74.55,4.88
  Bottom 0.406: U5.16 81.35,6.76 80.73,6.15 76.67,6.15 75.27,4.75 | C20.1 75.27,4.75 | v74.55,4.88 75.15,4.88 75.27,4.75

### Text on the board
tPlace: C.H.I.P. SmartPhone Core v0.2
bPlace: U
bNames: TX | GND